# Altium schematic sheet Ethernet.SchDoc
size A4; Author: ALTIUM GOSTBOM2.0 KEV; SheetNumber: 6; SheetTotal: 7
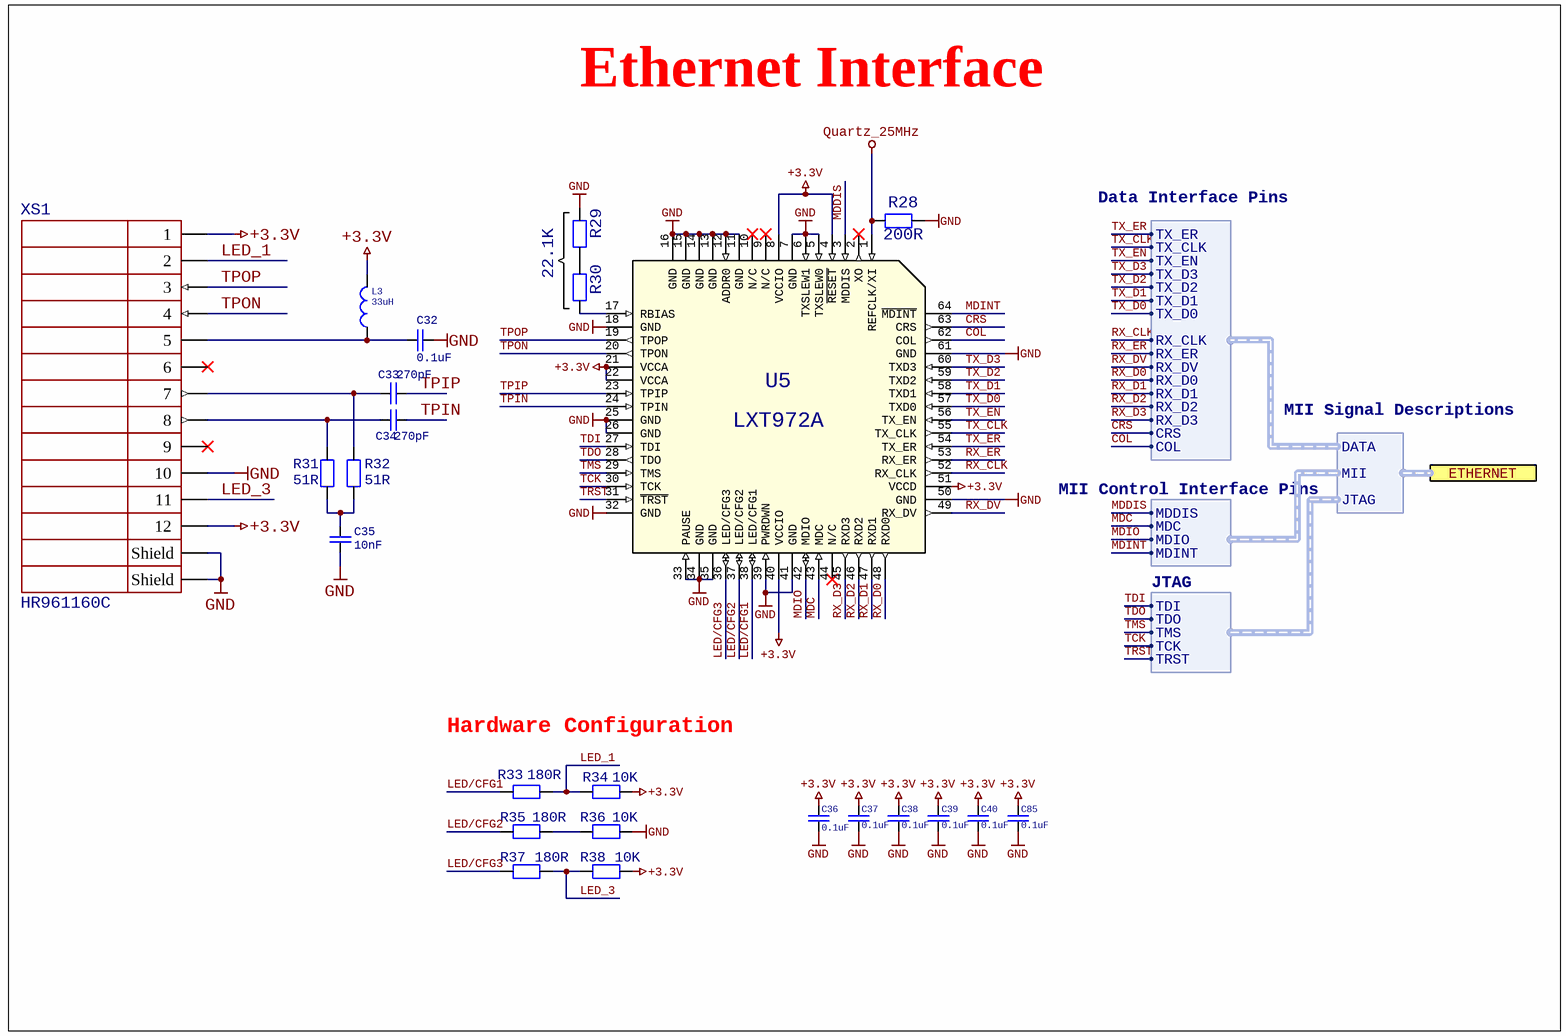
[diagram p0: Ethernet.SchDoc]

## Parts
C32  0.1uF  [C_0603]
C33  270pF  [C_0603]
C34  270pF  [C_0603]
C35  10nF  [C_0603]
C36  0.1uF  [C_0603]
C37  0.1uF  [C_0603]
C38  0.1uF  [C_0603]
C39  0.1uF  [C_0603]
C40  0.1uF  [C_0603]
C85  0.1uF  [C_0603]
L3  33uH  [L_1206]
R28  200R  [R_0603]
R29  ?  [R_0603]  (value not drawn)
R30  22.1K  [R_0603]
R31  51R  [R_0603]
R32  51R  [R_0603]
R33  180R  [R_0603]
R34  10K  [R_0603]
R35  180R  [R_0603]
R36  10K  [R_0603]
R37  180R  [R_0603]
R38  10K  [R_0603]
U5  LXT972A  [LQFP-64]
XS1  HR961160C  [HR961160C]

## Ports
ETHERNET (harness MII Signal Descriptions)

## Harnesses
MII Control Interface Pins: MDDIS, MDC, MDIO, MDINT
Data Interface Pins: TX_ER, TX_CLK, TX_EN, TX_D3, TX_D2, TX_D1, TX_D0, RX_CLK, RX_ER, RX_DV, RX_D0, RX_D1, RX_D2, RX_D3, CRS, COL
JTAG: TDI, TDO, TMS, TCK, TRST
MII Signal Descriptions: MII, DATA, JTAG

## Nets
+3.3V: C36.1 C37.1 C38.1 C39.1 C40.1 C85.1 L3.2 R34.2 R38.2 U5.4(~{RESET}) U5.8(VCCIO) U5.21(VCCA) U5.22(VCCA) U5.40(VCCIO) U5.51(VCCD) XS1.1 XS1.12
GND: C32.2 C35.2 C36.2 C37.2 C38.2 C39.2 C40.2 C85.2 R28.2 R29.2 R36.2 U5.5(TXSLEW0) U5.6(TXSLEW1) U5.7(GND) U5.11(GND) U5.12(ADDR0) U5.13(GND) U5.14(GND) U5.15(GND) U5.16(GND) U5.18(GND) U5.25(GND) U5.26(GND) U5.32(GND) U5.33(PAUSE) U5.34(GND) U5.35(GND) U5.39(PWRDWN) U5.41(GND) U5.50(GND) U5.61(GND) XS1.10 XS1.Shield
Quartz_25MHz: R28.1 U5.1(REFCLK/XI)
COL: U5.62(COL) ; harness Data Interface Pins.COL
CRS: U5.63(CRS) ; harness Data Interface Pins.CRS
LED/CFG1: R33.1 U5.38(LED/CFG1)
LED/CFG2: R35.1 U5.37(LED/CFG2)
LED/CFG3: R37.1 U5.36(LED/CFG3)
LED_1: R33.2 R34.1 XS1.2
LED_3: R37.2 R38.1 XS1.11
MDC: U5.43(MDC) ; harness MII Control Interface Pins.MDC
MDDIS: U5.3(MDDIS) ; harness MII Control Interface Pins.MDDIS
MDINT: U5.64(~{MDINT}) ; harness MII Control Interface Pins.MDINT
MDIO: U5.42(MDIO) ; harness MII Control Interface Pins.MDIO
RX_CLK: U5.52(RX_CLK) ; harness Data Interface Pins.RX_CLK
RX_D0: U5.48(RXD0) ; harness Data Interface Pins.RX_D0
RX_D1: U5.47(RXD1) ; harness Data Interface Pins.RX_D1
RX_D2: U5.46(RXD2) ; harness Data Interface Pins.RX_D2
RX_D3: U5.45(RXD3) ; harness Data Interface Pins.RX_D3
RX_DV: U5.49(RX_DV) ; harness Data Interface Pins.RX_DV
RX_ER: U5.53(RX_ER) ; harness Data Interface Pins.RX_ER
TCK: U5.30(TCK) ; harness JTAG.TCK
TDI: U5.27(TDI) ; harness JTAG.TDI
TDO: U5.28(TDO) ; harness JTAG.TDO
TMS: U5.29(TMS) ; harness JTAG.TMS
TPIN: C34.2 U5.24(TPIN)
TPIP: C33.2 U5.23(TPIP)
TPON: U5.20(TPON) XS1.4
TPOP: U5.19(TPOP) XS1.3
TRST: U5.31(~{TRST}) ; harness JTAG.TRST
TX_CLK: U5.55(TX_CLK) ; harness Data Interface Pins.TX_CLK
TX_D0: U5.57(TXD0) ; harness Data Interface Pins.TX_D0
TX_D1: U5.58(TXD1) ; harness Data Interface Pins.TX_D1
TX_D2: U5.59(TXD2) ; harness Data Interface Pins.TX_D2
TX_D3: U5.60(TXD3) ; harness Data Interface Pins.TX_D3
TX_EN: U5.56(TX_EN) ; harness Data Interface Pins.TX_EN
TX_ER: U5.54(TX_ER) ; harness Data Interface Pins.TX_ER
NetC32_1: C32.1 L3.1 XS1.5
NetC33_1: C33.1 R32.1 XS1.7
NetC34_1: C34.1 R31.1 XS1.8
NetC35_1: C35.1 R31.2 R32.2
NetR29_1: R29.1 R30.1
NetR30_2: R30.2 U5.17(RBIAS)
NetR35_2: R35.2 R36.1

Not connected (* = marked no-connect by the designer): U5 2(XO)* 9(N/C)* 10(N/C)* 44(N/C)*; XS1 6* 9*

## Notes on the sheet
- Ethernet Interface
- Hardware Configuration
- Перв. примен.
- Справ. №
- Подп. дата
- Инв. № дубл.
- Взам. инв. №
- Подп. и дата
- Изм.
- Разраб.
- Лист
- № докум.
- Подп.
- Дата
- Лит.
- Масса
- Масштаб
- Пров.
- Т.контр.
- Листов
- Инв. № подл.
- Н.контр.
- Утв.
- ALTIUM GOSTBOM2.0 KEV
- Файл:
- Копировал
- Формат А3

## Library data of the parts
C32-C40 C85 = C: Non-polarised capacitor; ComponentLink1Description: Manufacturer Link; ComponentLink1URL: www.murata.com; ComponentLink2Description: Datasheet Link; ComponentLink2URL: http://www.murata.com/products/catalog/pdf/c02e.pdf; ValueSCH: *
L3 = L_2
R28-R38 = R
U5 = LXT972A: 10/100 Ethernet Transceiver